# Altium project E77T.PrjPcb
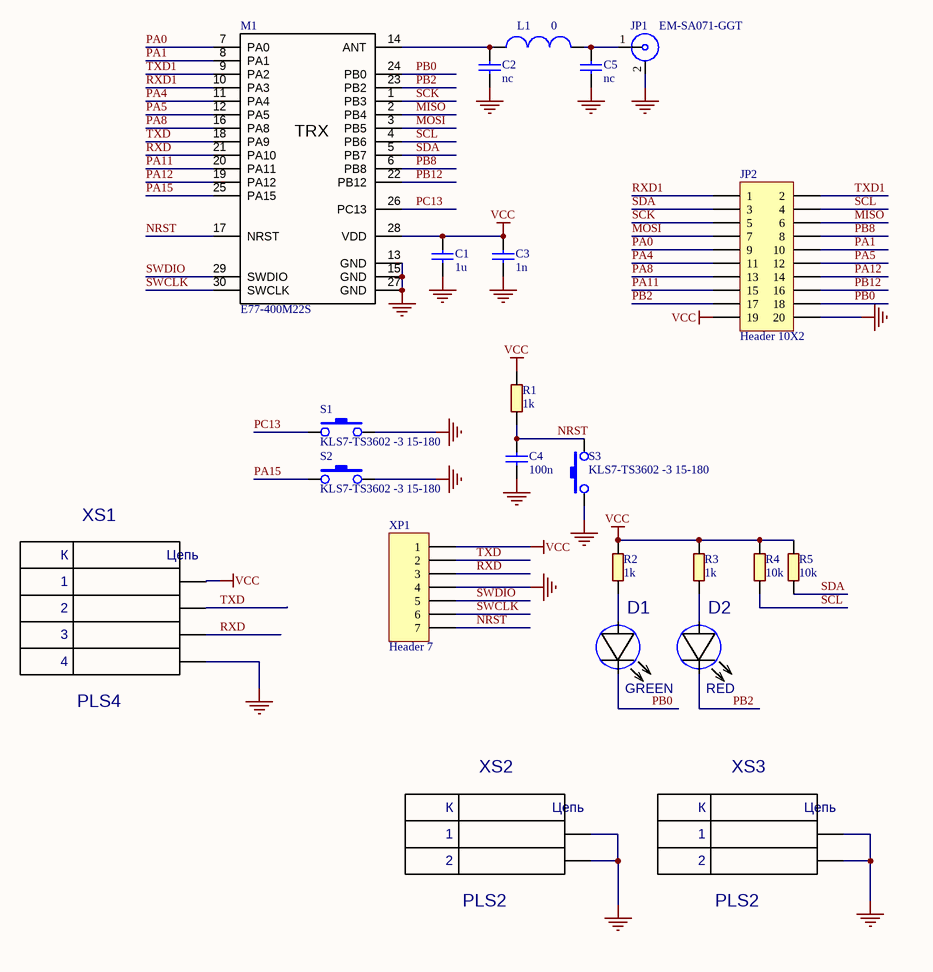
[diagram p0: E77T.SchDoc]
1 sheet, 23 parts. Net scope: global (net labels, ports and power ports of the same name join across sheets).
Board file: E77T.PcbDoc

## Sheet E77T.SchDoc
size 209 x 297 mm; SheetNumber: 1; SheetTotal: 1; SPICEModelCacheXSTIBOJF: <root> / <DocumentId>XSTIBOJF</DocumentId> / </root>

### Parts
C1  1u  [C-0603]
C2  nc  [C-0603]
C3  1n  [C-0603]
C4  100n  [C-0603]
C5  nc  [C-0603]
D1  value GREEN  [LED_3mm_RED]  (hidden comment: LED3mm)
D2  value RED  [LED_3mm_RED]  (hidden comment: LED3mm)
JP1  EM-SA071-GGT  [SMA_F_EDGE]
JP2  Header 10X2  [HDR2X10]
L1  0  [L-0603]
M1  E77-400M22S  [E77XX-M22]
R1  1k  [R-0603]
R2  1k  [R-0603]
R3  1k  [R-0603]
R4  10k  [R-0603]
R5  10k  [R-0603]
S1  KLS7-TS3602 -3 15-180  [BUTT_MIN]
S2  KLS7-TS3602 -3 15-180  [BUTT_MIN]
S3  KLS7-TS3602 -3 15-180  [BUTT_MIN]
XP1  Header 7  [PLS1-7R]
XS1  PLS4  [PLS4 - 3D]
XS2  PLS2  [PLS2 - 3D]
XS3  PLS2  [PLS2 - 3D]

### Nets
GND: C1.2 C2.2 C3.2 C4.2 C5.2 JP1.2 JP2.20 M1.13(GND) M1.15(GND) M1.27(GND) S1.2 S2.2 S3.1 XP1.4 XS1.4 XS2.1 XS2.2 XS3.1 XS3.2
VCC: C1.1 C3.1 JP2.19 M1.28(VDD) R1.2 R2.2 R3.2 R4.2 R5.2 XP1.1 XS1.1
MISO: JP2.6 M1.2(PB4)
MOSI: JP2.7 M1.3(PB5)
NRST: C4.1 M1.17(NRST) R1.1 S3.2 XP1.7
PA0: JP2.9 M1.7(PA0)
PA1: JP2.10 M1.8(PA1)
PA4: JP2.11 M1.11(PA4)
PA5: JP2.12 M1.12(PA5)
PA8: JP2.13 M1.16(PA8)
PA11: JP2.15 M1.20(PA11)
PA12: JP2.14 M1.19(PA12)
PA15: M1.25(PA15) S2.1
PB0: D1.2 JP2.18 M1.24(PB0)
PB2: D2.2 JP2.17 M1.23(PB2)
PB8: JP2.8 M1.6(PB8)
PB12: JP2.16 M1.22(PB12)
PC13: M1.26(PC13) S1.1
RXD: M1.21(PA10) XP1.3 XS1.3
RXD1: JP2.1 M1.10(PA3)
SCK: JP2.5 M1.1(PB3)
SCL: JP2.4 M1.4(PB6) R4.1
SDA: JP2.3 M1.5(PB7) R5.1
SWCLK: M1.30(SWCLK) XP1.6
SWDIO: M1.29(SWDIO) XP1.5
TXD: M1.18(PA9) XP1.2 XS1.2
TXD1: JP2.2 M1.9(PA2)
NetC2_1: C2.1 L1.1 M1.14(ANT)
NetC5_1: C5.1 JP1.1 L1.2
NetD1_1: D1.1 R2.1
NetD2_1: D2.1 R3.1

### Notes on the sheet
- Перв. примен.
- Справ. №
- Подп. и дата
- Инв. № дубл.
- Взам. инв. №
- Изм.
- Лист
- № докум.
- Подп.
- Дата
- Лит.
- Масса
- Масштаб
- Т.контр.
- Пров.
- Разраб.
- Листов
- Инв. № подл.
- Н.контр.
- Утв.
- Копировал
- Формат А4
- (in symbol E77-400M22S) TRX
- (in symbol PLS2) К; Цепь
- (in symbol PLS4) К; Цепь

### Library data of the parts
C1-C5 = CAPN: Voltage: 50V; Точність/група: NP0; Вид: Конденсатор
D1 D2 = LED3mm: Mounting  Method: THT
JP1 = SMA: SMA Female R/A PCB Mount; Вид: Роз'єм
JP2 = Header 10X2: Header, 10-Pin, Dual row; LatestRevisionDate: 17-Jul-2002; LatestRevisionNote: Re-released for DXP Platform.; Publisher: Altium Limited
L1 = L: Вид: Індуктивність
R1-R5 = RES: Точність/група: 5%; Вид: Резистор
S1-S3 = SW-1: Вид: Кнопка; Робоча напруга: *
XP1 = Header 7: Header, 7-Pin; LatestRevisionDate: 17-Jul-2002; LatestRevisionNote: Re-released for DXP Platform.; Publisher: Altium Limited
XS1 = PLS4: Value: {Value}; Mounting  Method: THT
XS2 XS3 = PLS2: Value: {Value}; Mounting  Method: THT